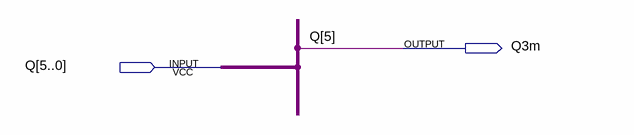
[diagram p0: schematic sheet]
// Quartus schematic GeneradorQ3.bdf as structural Verilog: 0 symbols, 2 pins
module GeneradorQ3 (
  input  [5:0] Q,
  output Q3m
);


  assign Q3m = Q[5];
endmodule
